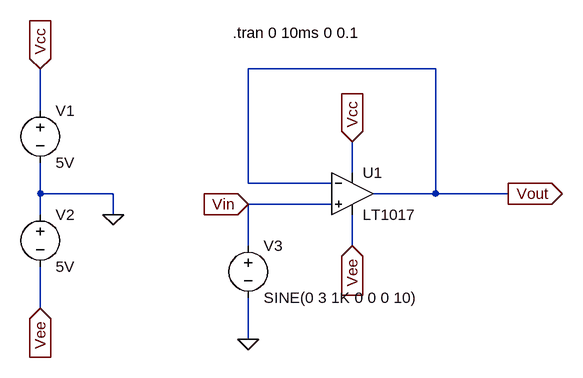
[diagram p0: schematic V_Follower.asc]
V_Follower.asc, the LTspice schematic file:
Version 4
SHEET 1 880 680
WIRE 320 -32 32 -32
WIRE -288 32 -288 -32
WIRE 192 128 192 80
WIRE 32 144 32 -32
WIRE 160 144 32 144
WIRE -288 160 -288 112
WIRE -176 160 -288 160
WIRE 320 160 320 -32
WIRE 320 160 224 160
WIRE 432 160 320 160
WIRE 160 176 32 176
WIRE -288 192 -288 160
WIRE -176 192 -176 160
WIRE 32 240 32 176
WIRE 192 240 192 192
WIRE -288 336 -288 272
WIRE 32 384 32 320
FLAG -176 192 0
FLAG -288 -32 Vcc
IOPIN -288 -32 In
FLAG -288 336 Vee
IOPIN -288 336 In
FLAG 192 80 Vcc
IOPIN 192 80 In
FLAG 192 240 Vee
IOPIN 192 240 In
FLAG 32 384 0
FLAG 432 160 Vout
IOPIN 432 160 Out
FLAG 32 176 Vin
IOPIN 32 176 In
SYMBOL Comparators\\LT1017 192 160 R0
SYMATTR InstName U1
SYMBOL voltage -288 16 R0
SYMATTR InstName V1
SYMATTR Value 5V
SYMBOL voltage -288 176 R0
SYMATTR InstName V2
SYMATTR Value 5V
SYMBOL voltage 32 224 R0
SYMATTR InstName V3
SYMATTR Value SINE(0 3 1K 0 0 0 10)
TEXT 8 -88 Left 2 !.tran 0 10ms 0 0.1

The netlist it stands for:
* V_Follower.asc
XU1 Vin Vout Vcc Vee Vout LT1017  ; pins In+ In- V+ V- OUT
V1 Vcc 0 5V
V2 0 Vee 5V
V3 Vin 0 SINE(0 3 1K 0 0 0 10)
.tran 0 10ms 0 0.1
.backanno
.end

* Results of the author's LTspice run, read from the files saved beside the schematic
* Operating Point, zero values left out:
*   V(vcc) = 5 V
*   V(vout) = 6.791 µV
*   V(vee) = -5 V
*   I(V3) = -3.1 nA
*   I(V2) = -212.9 µA
*   I(V1) = -212.9 µA
*   Ix(u1:1) = 3.1 nA
*   Ix(u1:2) = 3.1 nA
*   Ix(u1:3) = 212.9 µA
*   Ix(u1:4) = -212.9 µA
*   Ix(u1:5) = -3.1 nA
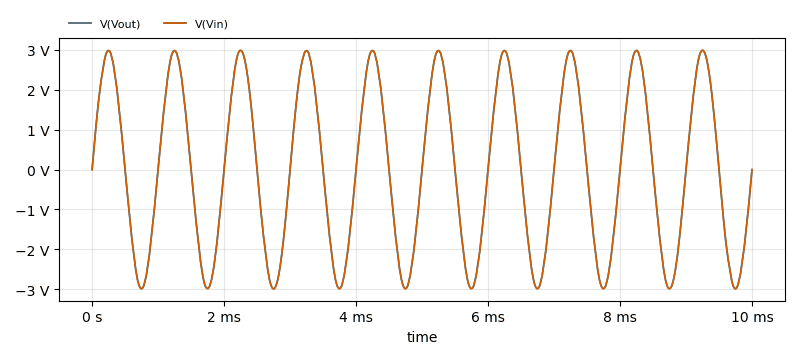
[diagram p1: Transient Analysis of V_Follower.asc, plotted from the saved traces]
* Transient Analysis, 1 run:
*   V(Vout): min -2.989 V, max 2.988 V, average 545.8 µV, rms 2.107 V, last -2.785 mV
*   V(Vin): min -2.989 V, max 2.988 V, average 546.4 µV, rms 2.107 V, last 0 V